# EAGLE design 3525 (EAGLE 9.6.2)
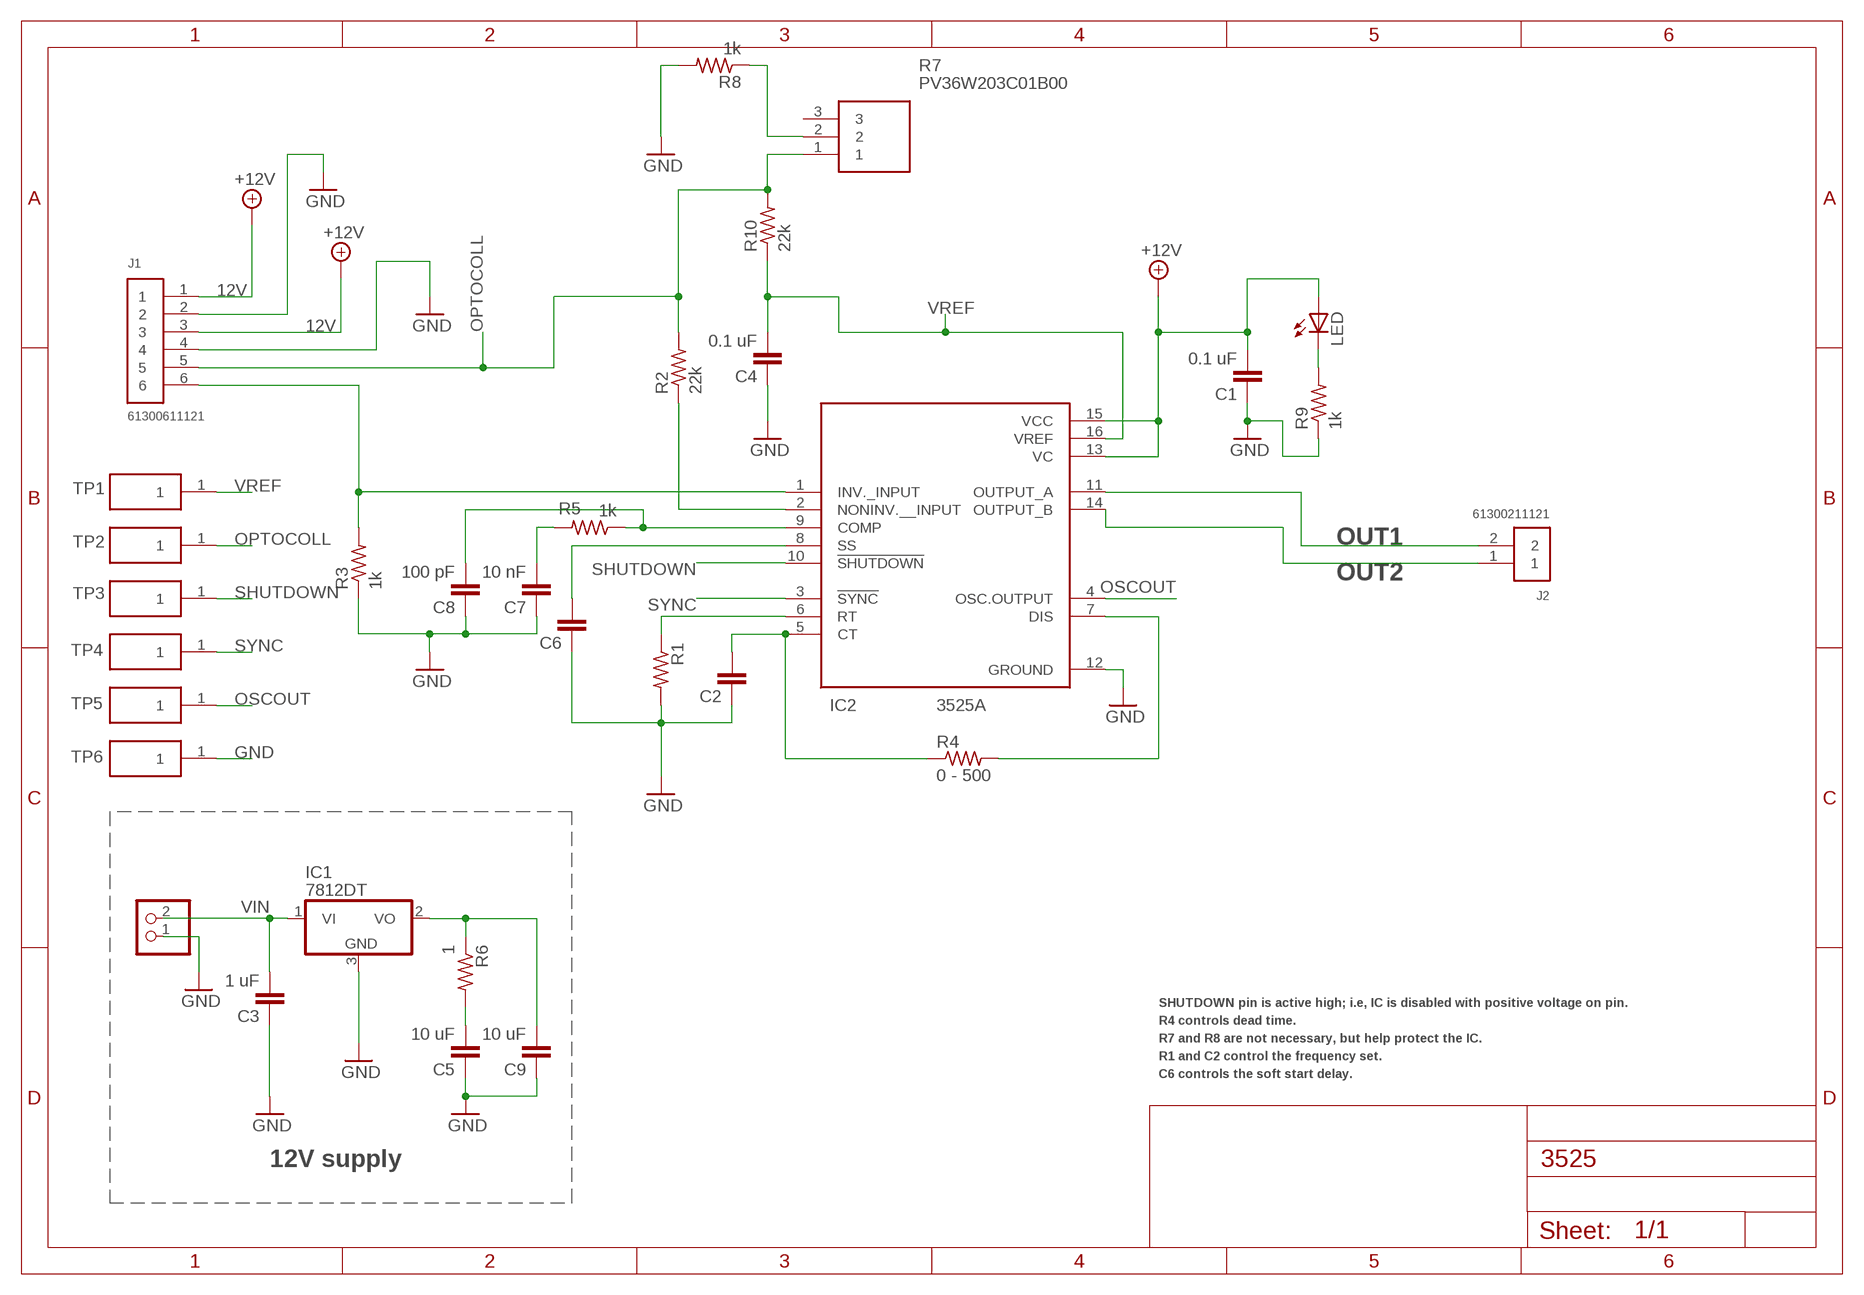
[diagram p0: schematic, sheet 1]

## Parts
C1  0.1 uF  C-EUC0805  [C0805]
C2  C-EUC0805K  [C0805K]
C3  1 uF  C-EUC0805K  [C0805K]
C4  0.1 uF  C-EUC0805K  [C0805K]
C5  10 uF  C-EUC0805K  [C0805K]
C6  C-EUC0805K  [C0805K]
C7  10 nF  C-EUC0805K  [C0805K]
C8  100 pF  C-EUC0805K  [C0805K]
C9  10 uF  C-EUC0805K  [C0805K]
IC1  7812DT  [TO252]
IC2  3525A  SG3525ADWR2G  [SOIC127P1030X265-16N]
J1  61300611121  [61300611121]
J2  61300211121  [61300211121]
LED  LEDCHIPLED_0805  [CHIPLED_0805]
R1  R-US_R0805  [R0805]
R2  22k  R-US_R0805  [R0805]
R3  1k  R-US_R0805  [R0805]
R4  0 - 500  R-US_R0805  [R0805]
R5  1k  R-US_R0805  [R0805]
R6  1  R-US_R0805  [R0805]
R7  PV36W203C01B00  [PV36W201C01B00]
R8  1k  R-US_R0805  [R0805]
R9  1k  R-US_R0805  [R0805]
R10  22k  R-US_R0805  [R0805]
SUPPLY  PINHD-1X2  [1X02]
TP1  RCT-0C  [RCT-0C]
TP2  RCT-0C  [RCT-0C]
TP3  RCT-0C  [RCT-0C]
TP4  RCT-0C  [RCT-0C]
TP5  RCT-0C  [RCT-0C]
TP6  RCT-0C  [RCT-0C]

## Nets
12V: C1.2 C9.2 IC1.2(VO) IC2.13(VC) IC2.15(VCC) J1.1 J1.3 LED.A R6.1 ; supply symbol labelled +12V
GND: C1.1 C2.1 C3.1 C4.1 C5.1 C6.1 C7.1 C8.1 C9.1 IC1.3(GND) IC2.12(GROUND) J1.2 J1.4 R1.2 R3.1 R8.2 R9.1 SUPPLY.1 TP6.1
N$1: R7.2 R8.1
N$2: C5.2 R6.2
N$3: C8.2 IC2.9(COMP) R5.1
N$6: IC2.7(DIS) R4.2
N$7: IC2.6(RT) R1.1
N$8: C2.2 IC2.5(CT) R4.1
N$10: C6.2 IC2.8(SS)
N$11: LED.C R9.2
N$13: C7.2 R5.2
N$15: IC2.1(INV._INPUT) J1.6 R3.2
N-INV: IC2.2(NONINV.__INPUT) R2.1
OPTOCOLL: J1.5 R2.2 R7.1 R10.2 TP2.1
OSCOUT: IC2.4(OSC.OUTPUT) TP5.1
OUT1: IC2.11(OUTPUT_A) J2.2
OUT2: IC2.14(OUTPUT_B) J2.1
SHUTDOWN: IC2.10(!SHUTDOWN) TP3.1
SYNC: IC2.3(!SYNC) TP4.1
VIN: C3.2 IC1.1(VI) SUPPLY.2
VREF: C4.2 IC2.16(VREF) R10.1 TP1.1
Unconnected: R7.3

## Notes on the sheet
- SHUTDOWN pin is active high; i.e, IC is disabled with positive voltage on pin.
- R4 controls dead time.
- R7 and R8 are not necessary, but help protect the IC.
- R1 and C2 control the frequency set.
- C6 controls the soft start delay.
- 12V supply

## Library data of the parts
C1 = rcl:C-EU: CAPACITOR, European symbol; SPICEPREFIX: C
C2-C9 = rcl:C-EU: CAPACITOR, European symbol
IC1 = linear:78*: Positive VOLTAGE REGULATOR Source: http://cache.national.com/ds/LM/LM78L05.pdf http://www.fairchildsemi.com/ds/LM/LM7805.pdf
IC2 = SamacSys_Parts:SG3525ADWR2G: Pulse Width Modulator Control Circuit Source: Datasheet <http://www.onsemi.com/pub/Collateral/SG3525A-D.PDF>; DESCRIPTION: Pulse Width Modulator Control Circuit; HEIGHT: 2.65mm; MANUFACTURER_NAME: ON Semiconductor; MANUFACTURER_PART_NUMBER: SG3525ADWR2G; MOUSER_PART_NUMBER: 863-SG3525ADWR2G; MOUSER_PRICE-STOCK: https://www.mouser.co.uk/ProductDetail/onsemi/SG3525ADWR2G?qs=xZq1yRCsb1e5MX%2FZSmewFg%3D%3D
J1 = Headers:61300611121: CONN HEADER VERT 6POS 2.54MM Manufacturer's datasheet <https://katalog.we-online.de/em/datasheet/6130xx11121.pdf>; CREATED_BY: PCBLayout.com; DIGI_KEY_PART_NUMBER: 732-5319-ND; MANUFACTURER: Wurth Electronics Inc.; MPN: 61300611121
J2 = Headers:61300211121: CONN HEADER VERT 2POS 2.54MM Manufacturer's datasheet <https://katalog.we-online.de/em/datasheet/6130xx11121.pdf>; CREATED_BY: PCBLayout.com; DIGI_KEY_PART_NUMBER: 732-5315-ND; MANUFACTURER: Wurth Electronics Inc.; MPN: 61300211121
LED = led:LED: LED OSRAM: - CHIPLED LG R971, LG N971, LY N971, LG Q971, LY Q971, LO R971, LY R971 LH N974, LH R974 LS Q976, LO Q976, LY Q976 LO Q996 - Hyper CHIPLED LW Q18S LB Q993, LB Q99A, LB R99A - SideLED LS A670, LO A670, LY A670, LG A670, LP A670 LB A673, LV A673, LT A673, LW A673 LH A674 LY A675 LS A676, LA A676, LO A676, LY A676, LW A676 LS A679, LY A679, LG A679 - Hyper Micro SIDELED® LS Y876, LA Y876, LO Y876, LY Y876 LT Y87S - SmartLED LW L88C, LW L88S LB L89C, LB L89S, LG L890 LS L89K, LO L89K, LY L89K LS L896, LA L896, LO L896, LY L896 - TOPLED LS T670, LO T670, LY T670, LG T670, LP T670 LSG T670, LSP T670, LSY T670, LOP T670, LYG T670 LG T671, LOG T671, LSG T671 LB T673, LV T673, LT T673, LW T673 LH T674 LS T676, LA T676, LO T676, LY T676, LB T676, LH T676, LSB T676, LW T676 LB T67C, LV T67C, LT T67C, LS T67K, LO T67K, LY T67K, LW E67C LS E67B, LA E67B, LO E67B, LY E67B, LB E67C, LV E67C, LT E67C LW T67C LS T679, LY T679, LG T679 LS T770, LO T770, LY T770, LG T770, LP T770 LB T773, LV T773, LT T773, LW T773 LH T774 LS E675, LA E675, LY E675, LS T675 LS T776, LA T776, LO T776, LY T776, LB T776 LHGB T686 LT T68C, LB T68C - Hyper Mini TOPLED® LB M676 - Mini TOPLED Santana® LG M470 LS M47K, LO M47K, LY M47K Source: http://www.osram.convergy.de LUXEON: - LUMILED® LXK2-PW12-R00, LXK2-PW12-S00, LXK2-PW14-U00, LXK2-PW14-V00 LXK2-PM12-R00, LXK2-PM12-S00, LXK2-PM14-U00 LXK2-PE12-Q00, LXK2-PE12-R00, LXK2-PE12-S00, LXK2-PE14-T00, LXK2-PE14-U00 LXK2-PB12-K00, LXK2-PB12-L00, LXK2-PB12-M00, LXK2-PB14-N00, LXK2-PB14-P00, LXK2-PB14-Q00 LXK2-PR12-L00, LXK2-PR12-M00, LXK2-PR14-Q00, LXK2-PR14-R00 LXK2-PD12-Q00, LXK2-PD12-R00, LXK2-PD12-S00 LXK2-PH12-R00, LXK2-PH12-S00 LXK2-PL12-P00, LXK2-PL12-Q00, LXK2-PL12-R00 Source: www.luxeon.com KINGBRIGHT: KA-3528ASYC Source: www.kingbright.com
R1-R6 R8-R10 = rcl:R-US_: RESISTOR, American symbol
R7 = SamacSys_Parts:PV36W203C01B00: Trimmer Resistors - Through Hole 20Kohms 10mm Square 25turn Source: Datasheet <http://www.bourns.com/docs/Product-Datasheets/pv36.pdf>; DESCRIPTION: Trimmer Resistors - Through Hole 20Kohms 10mm Square 25turn; HEIGHT: 10.03mm; MANUFACTURER_NAME: Bourns; MANUFACTURER_PART_NUMBER: PV36W203C01B00; MOUSER_PART_NUMBER: 81-PV36W203C01B00; MOUSER_PRICE-STOCK: https://www.mouser.co.uk/ProductDetail/Bourns/PV36W203C01B00?qs=ifmdR88tEJ99ema2C36ddg%3D%3D
SUPPLY = pinhead:PINHD-1X2: PIN HEADER
TP1-TP6 = SamacSys_Parts:RCT-0C: TE CONNECTIVITY / CGS - RCT-0C - TEST POINT, 0805 CASE SIZE Source: Datasheet; DESCRIPTION: TE CONNECTIVITY / CGS - RCT-0C - TEST POINT, 0805 CASE SIZE; HEIGHT: mm; MANUFACTURER_NAME: TE Connectivity; MANUFACTURER_PART_NUMBER: RCT-0C; MOUSER_PART_NUMBER: 279-RCT-0C; MOUSER_PRICE-STOCK: https://www.mouser.co.uk/ProductDetail/TE-Connectivity-Holsworthy/RCT-0C?qs=ip69W3eHERWzZOsRKmFYAw%3D%3D

## Board
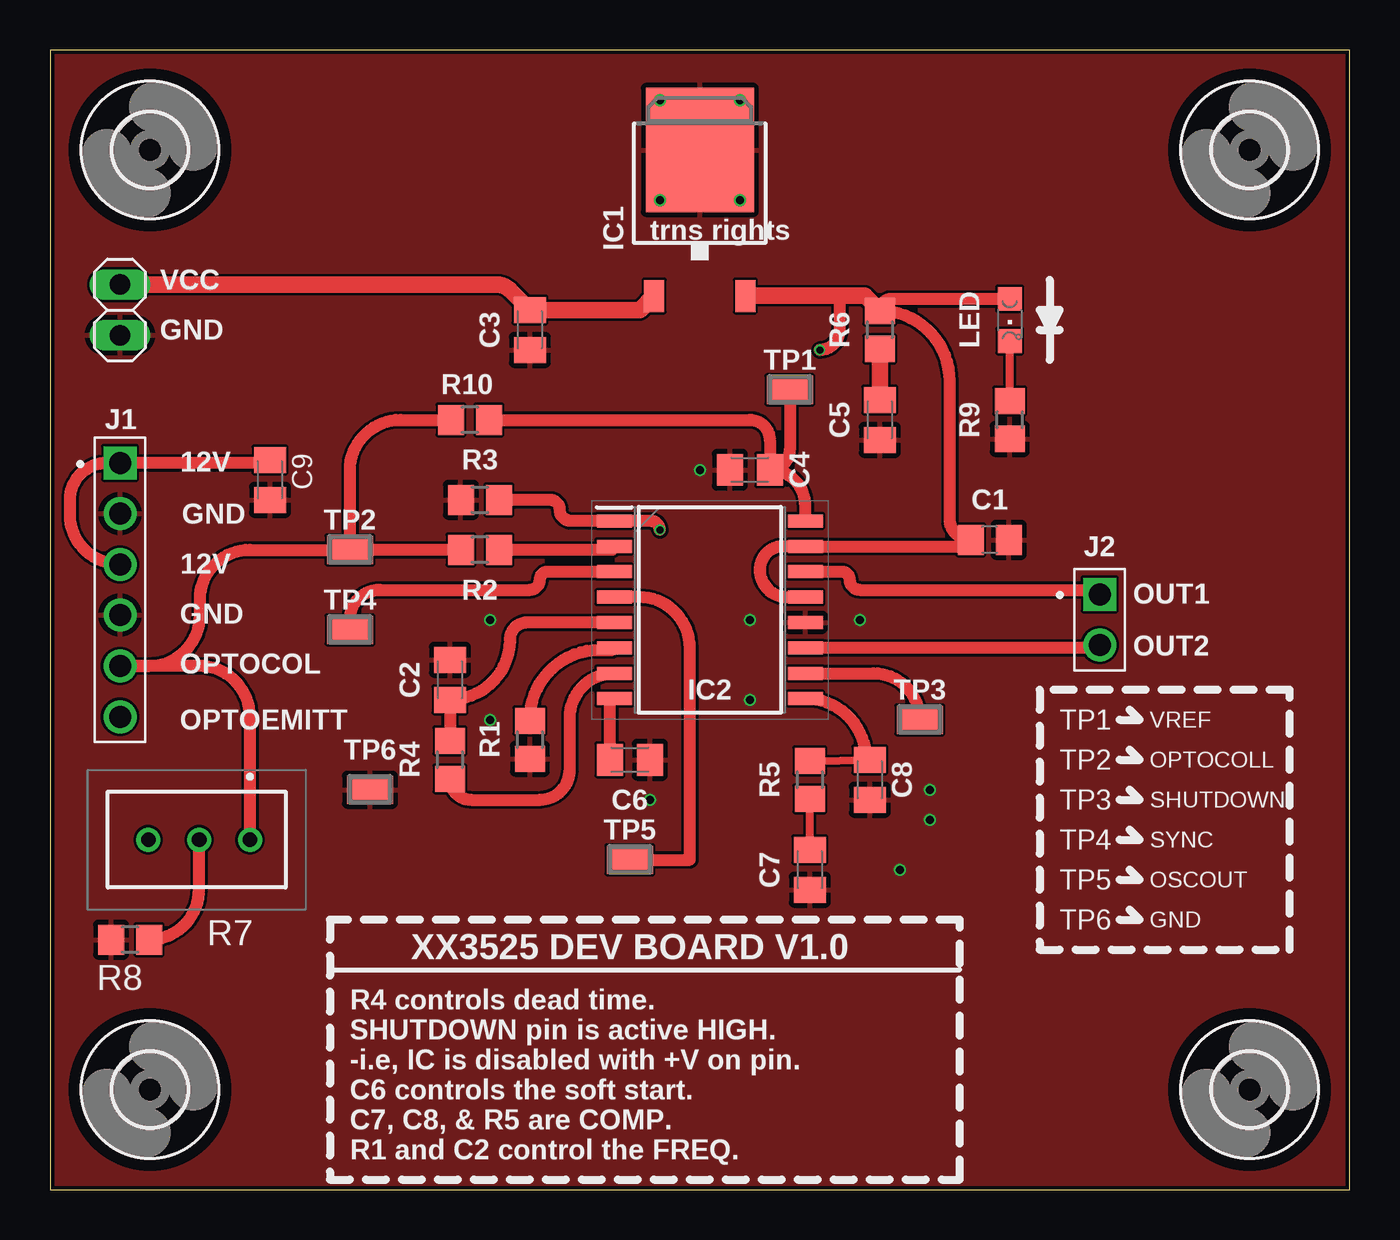
[diagram p1: board, top side]
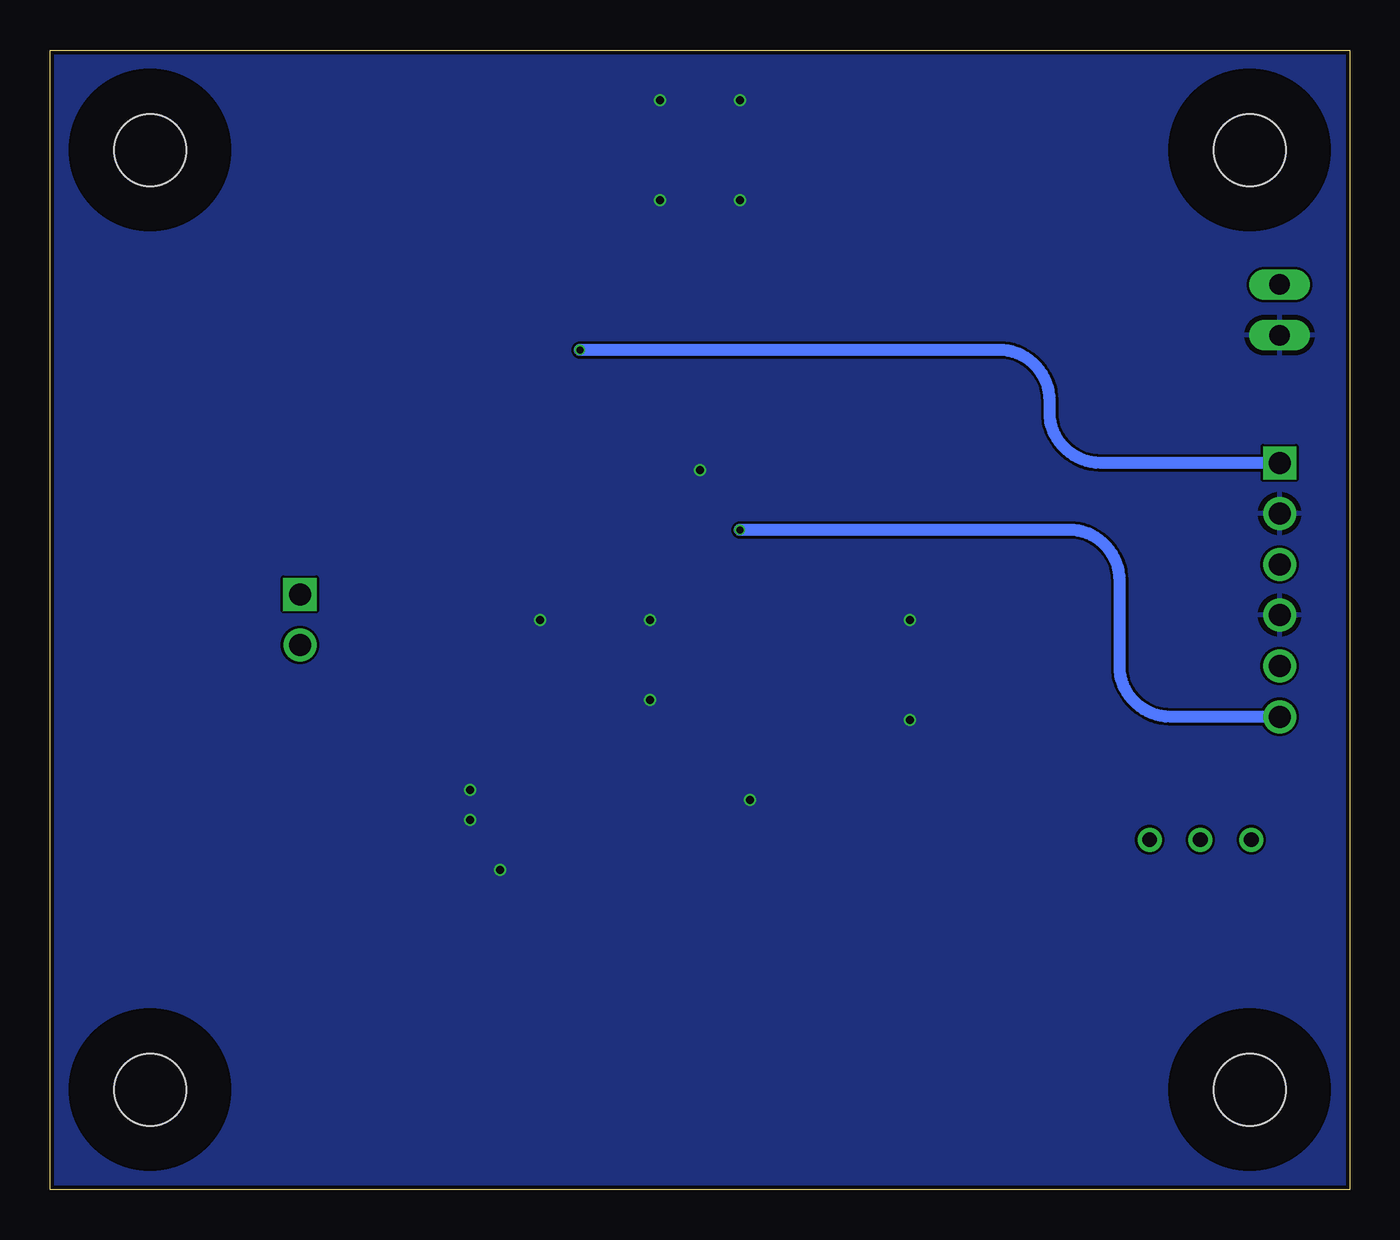
[diagram p2: board, bottom side, seen from below]

Size 65 x 57 mm. Coordinates in mm from the lower left corner, seen from the top.
Outline: 0,0 65,0 65,57 0,57 0,0
Copper layers (1*16): Top 0.035559375mm / dielectric 1.6mm / Bottom 0.035559375mm
Design rules "jlcpcb2layer *": minimum track width 5mil, minimum drill 12mil, track to track 5mil, track to pad 5mil, pad to pad 5mil, via to via 5mil, smd to smd 5mil, copper to edge 8mil, drill to drill 6mil, minimum pad ring 5mil, minimum via ring 3mil, stop-mask expansion 2.5mil, vias tented up to drill 20mil, thermal gap 10mil

### Footprints (pad centres in the part's own frame; a part is rotated, then mirrored left to right if it is on the bottom)
C0805 = smd 1.3 x 1.5: 1 -0.95,0; 2 0.95,0
C0805K = smd 1.3 x 1.6: 1 -1,0; 2 1,0
TO252 = smd 1 x 1.6: 1 -2.28,-4.8; 2 2.28,-4.8 | smd 5.4 x 6.2: 3 0,2.5
SOIC127P1030X265-16N = smd 1.75 x 0.65: 1 -4.775,4.445; 2 -4.775,3.175; 3 -4.775,1.905; 4 -4.775,0.635; 5 -4.775,-0.635; 6 -4.775,-1.905; 7 -4.775,-3.175; 8 -4.775,-4.445; 9 4.775,-4.445; 10 4.775,-3.175; 11 4.775,-1.905; 12 4.775,-0.635; 13 4.775,0.635; 14 4.775,1.905; 15 4.775,3.175; 16 4.775,4.445
61300611121 = drill 1.1 square: 1 -6.35,0 | drill 1.1: 2 -3.81,0; 3 -1.27,0; 4 1.27,0; 5 3.81,0; 6 6.35,0
61300211121 = drill 1.1 square: 1 -1.27,0 | drill 1.1: 2 1.27,0
CHIPLED_0805 = smd 1.2 x 1.2: A 0,-1.05; C 0,1.05
R0805 = smd 1.3 x 1.5: 1 -0.95,0; 2 0.95,0
PV36W201C01B00 = drill 0.74 pad 1.2: 1 0,0; 2 0,2.54; 3 0,5.08
1X02 = drill 1.016 long: 1 -1.27,0; 2 1.27,0
RCT-0C = smd 2.3 x 1.4: 1 0,0
3,6 = hole 3.6: 0,0

### Placement (x,y rotation side)
C1  47,32.5 180 top
C2  20,25.5 270 top
C3  24,43 90 top
C4  35,36 0 top
C5  41.5,38.5 90 top
C6  29,21.5 180 top
C7  38,16 90 top
C8  41,20.5 90 top
C9  11,35.5 90 top
IC1  32.5,49.5 0 top
IC2  33,29 0 top
J1  3.5,30 270 top
J2  52.5,28.5 270 top
LED  48,43.5 180 top
R1  24,22.5 270 top
R2  21.5,32 180 top
R3  21.5,34.5 0 top
R4  20,21.5 270 top
R5  38,20.5 270 top
R6  41.5,43 270 top
R7  10,17.5 90 top
R8  4,12.5 180 top
R9  48,38.5 90 top
R10  21,38.5 180 top
SUPPLY  3.5,44 90 top
TP1  37,40 0 top
TP2  15,32 0 top
TP3  43.5,23.5 0 top
TP4  15,28 0 top
TP5  29,16.5 0 top
TP6  16,20 0 top
U$1  [3,6]  5,52 0 top
U$2  [3,6]  60,52 0 top
U$3  [3,6]  5,5 0 top
U$4  [3,6]  60,5 0 top

### Tracks (layer width: path | path; a pad name or v marks a point on that pad's centre or on a via)
12V  (via drill 0.35)
  Top 0.61: LED.A 42.1,44.55 arc90 R6.1 arc-90 45,40.45 45,33.55 arc90 C1.2 arc-90 45.73,32.17 IC2.15 36.67,32.17 arc90 35.5,31 arc90 36.87,29.64 IC2.13 | v38.5,42 arc90 39.5,43 39.5,44.7 | J1.3 arc-90 1,33.77 1,34.5 arc-90 2.85,36.35 J1.1 10.85,36.35 arc90 C9.2
  Top 0.813: IC1.2 39.5,44.7 40.75,44.7 R6.1
  Bottom 0.61: J1.1 12.46,36.35 arc90 15,38.89 15,39.46 arc-90 17.54,42 v38.5,42
GND  (via drill 0.4)
  other vias: 22,23.5 22,28.5 42.5,16 30.5,49.5 34.5,49.5 34.5,54.5 30.5,54.5 35,24.5 44,20 44,18.5 30,19.5 40.5,28.5 35,28.5 32.5,36
  pour Top: 73.5,57.5 -7.5,57.5 -10,55 -5,52 -5,25 -6,25 -8,-4.5 73.5,-3
  pour Bottom: 68.5,60 -8,60 -8,40.5 -5.5,40.5 -5.5,25 -5,-3.5 67.5,-3.5
N$1
  Top 0.61: R8.1 arc90 7.46,15.01 R7.2
N$2
  Top 0.813: C5.2 R6.2
N$3
  Top 0.406: R5.1 C8.2
  Top 0.61: C8.2 40.83,21.5 arc90 IC2.9
N$6
  Top 0.61: R4.2 arc90 21.05,19.5 24.5,19.5 arc90 26,21 26,23.6 arc-90 IC2.7
N$7
  Top 0.406: R1.1 24,23.5 | 28.13,27 arc90 IC2.6
  Top 0.61: 24,23.5 arc-90 27.5,27 28.13,27
N$8
  Top 0.61: R4.1 C2.2 arc90 23,27.5 arc-90 23.86,28.36 IC2.5
N$10
  Top 0.406: 28,24.33 arc-90 IC2.8
  Top 0.61: C6.2 28,24.33
N$11
  Top 0.406: R9.2 LED.C
N$13
  Top 0.406: C7.2 R5.2
N$15  (via drill 0.35)
  Top 0.61: R3.2 25,34.5 arc-90 25.5,34 arc90 26.05,33.45 IC2.1 30.05,33.45 arc-90 v30.5,33
  Bottom 0.61: J1.6 8.96,23.65 arc90 11.5,26.19 11.5,30.46 arc-90 14.04,33 v30.5,33
N-INV
  Top 0.61: IC2.2 arc-90 28.05,32 R2.1
OPTOCOLL
  Top 0.61: R2.2 TP2.1 | TP2.1 10,32 arc90 7.5,29.5 7.5,28.73 arc-90 4.96,26.19 J1.5 7.46,26.19 arc-90 10,23.65 R7.1 | TP2.1 15,35.96 arc-90 17.54,38.5 R10.2
OSCOUT
  Top 0.61: TP5.1 32,16.5 32,27.09 arc90 29.46,29.64 IC2.4
OUT1
  Top 0.61: J2.2 arc-90 52.37,27.09 IC2.11
OUT2
  Top 0.61: IC2.14 39.59,30.91 arc-90 40,30.5 arc90 40.5,30 52.27,30 arc-90 J2.1
SHUTDOWN
  Top 0.61: IC2.10 41.17,25.82 arc-90 TP3.1
SYNC
  Top 0.61: TP4.1 15,28.5 arc-90 16.5,30 24,30 arc90 24.5,30.5 arc-90 24.91,30.91 IC2.3
VIN
  Top 0.813: SUPPLY.2 22.32,45.27 arc-45 23.02,44.98 C3.2 29.52,44 IC1.1
VREF
  Top 0.61: IC2.16 37.77,34.23 arc90 C4.2 | R10.1 35,38.5 arc-90 36,37.5 C4.2 | TP1.1 37,37 arc-90 C4.2

### Text on the board
tNames: trns rights | VCC | GND | 12V | GND | 12V | OUT1 | GND | OUT2 | OPTOCOL | OPTOEMITT | TP1 | VREF | TP2 | OPTOCOLL | TP3 | SHUTDOWN | TP4 | SYNC | TP5 | OSCOUT | TP6 | GND | XX3525 DEV BOARD V1.0 | R4 controls dead time. | SHUTDOWN pin is active HIGH. | -i.e, IC is disabled with +V on pin. | C6 controls the soft start. | C7, C8, & R5 are COMP. | R1 and C2 control the FREQ.